# Altium schematic sheet 02 POWER,BEEP,IrDA.SchDoc
size 513 x 386 mm
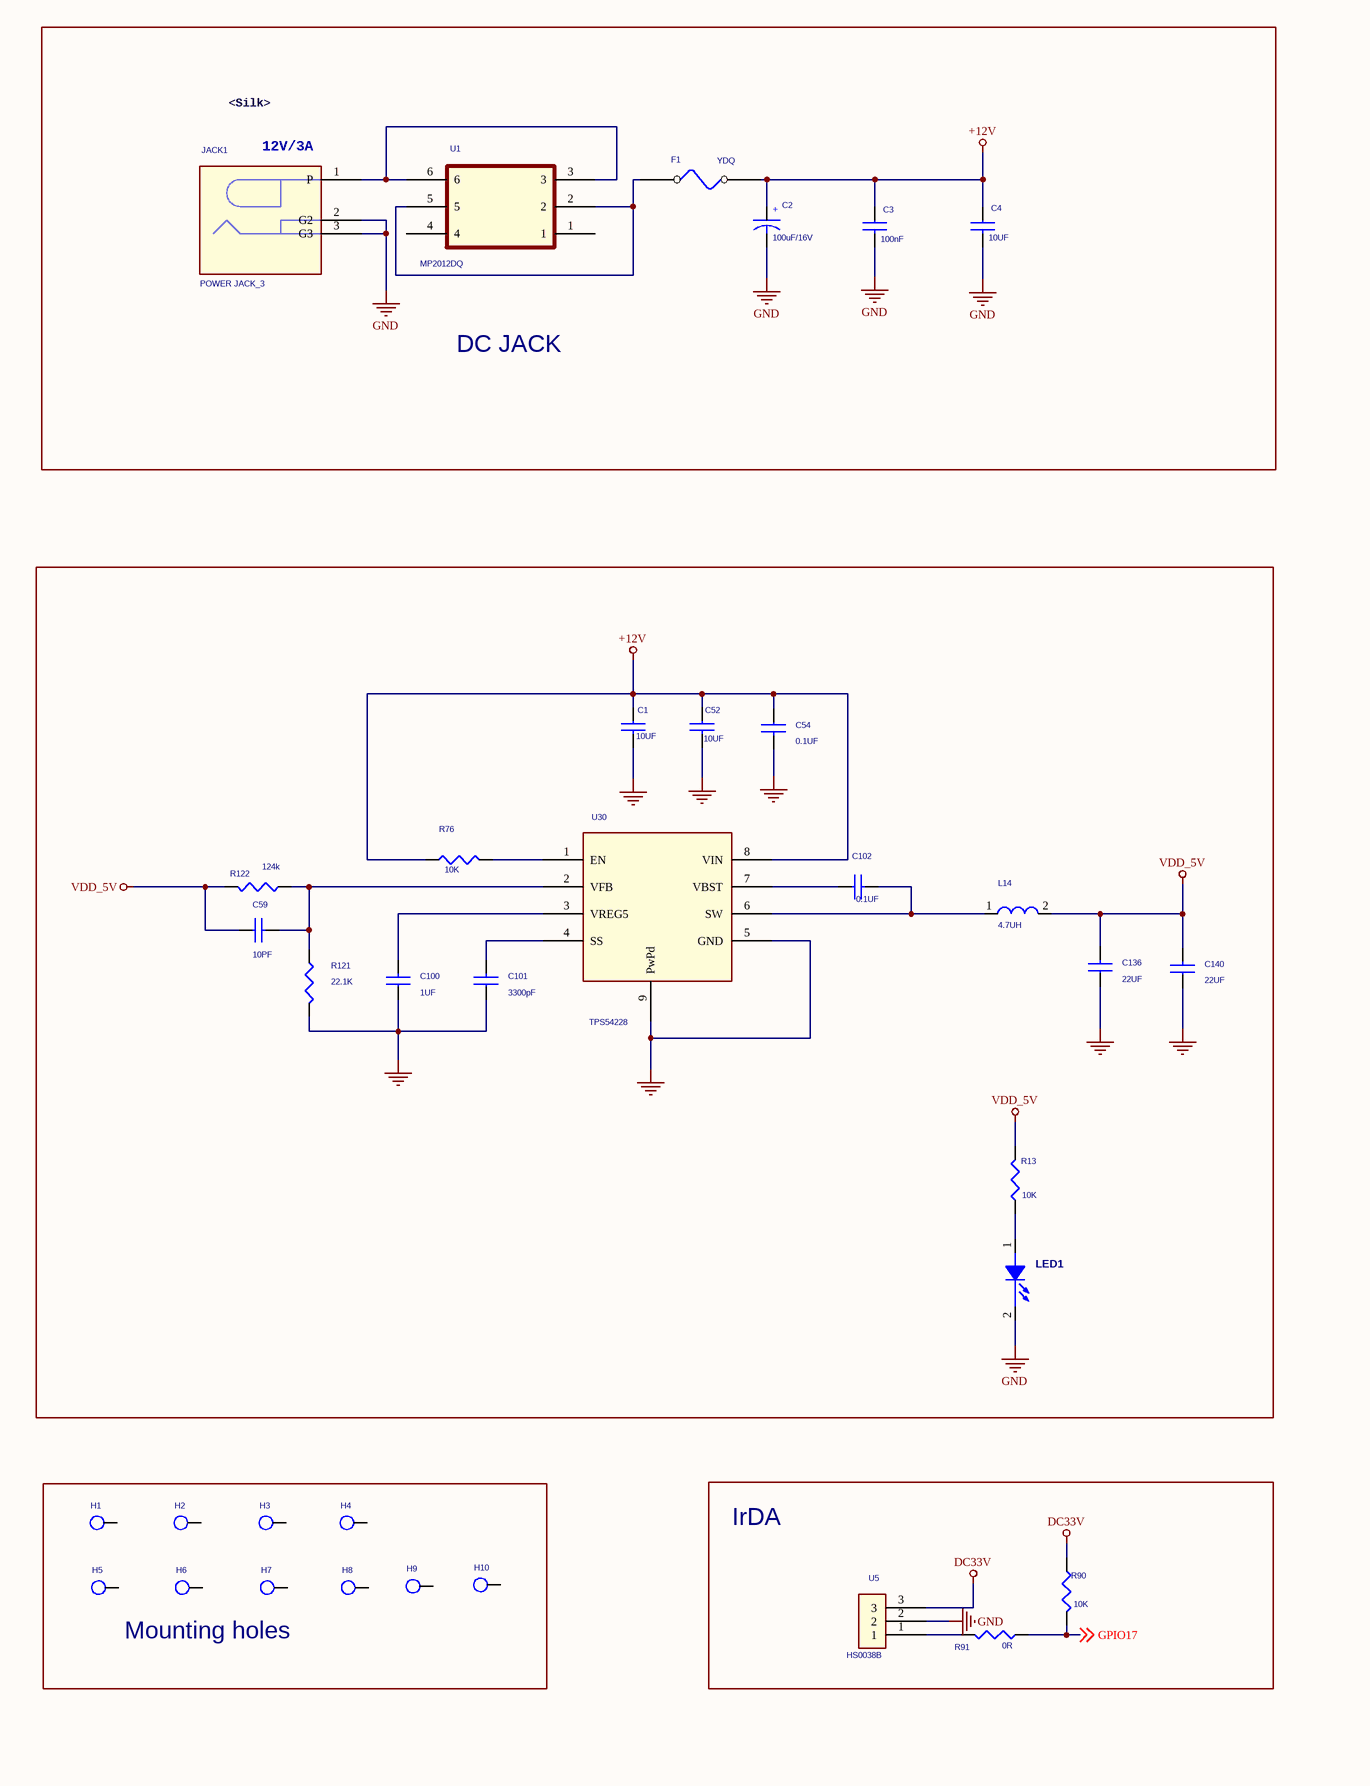
[diagram p0: 02 POWER,BEEP,IrDA.SchDoc, left]
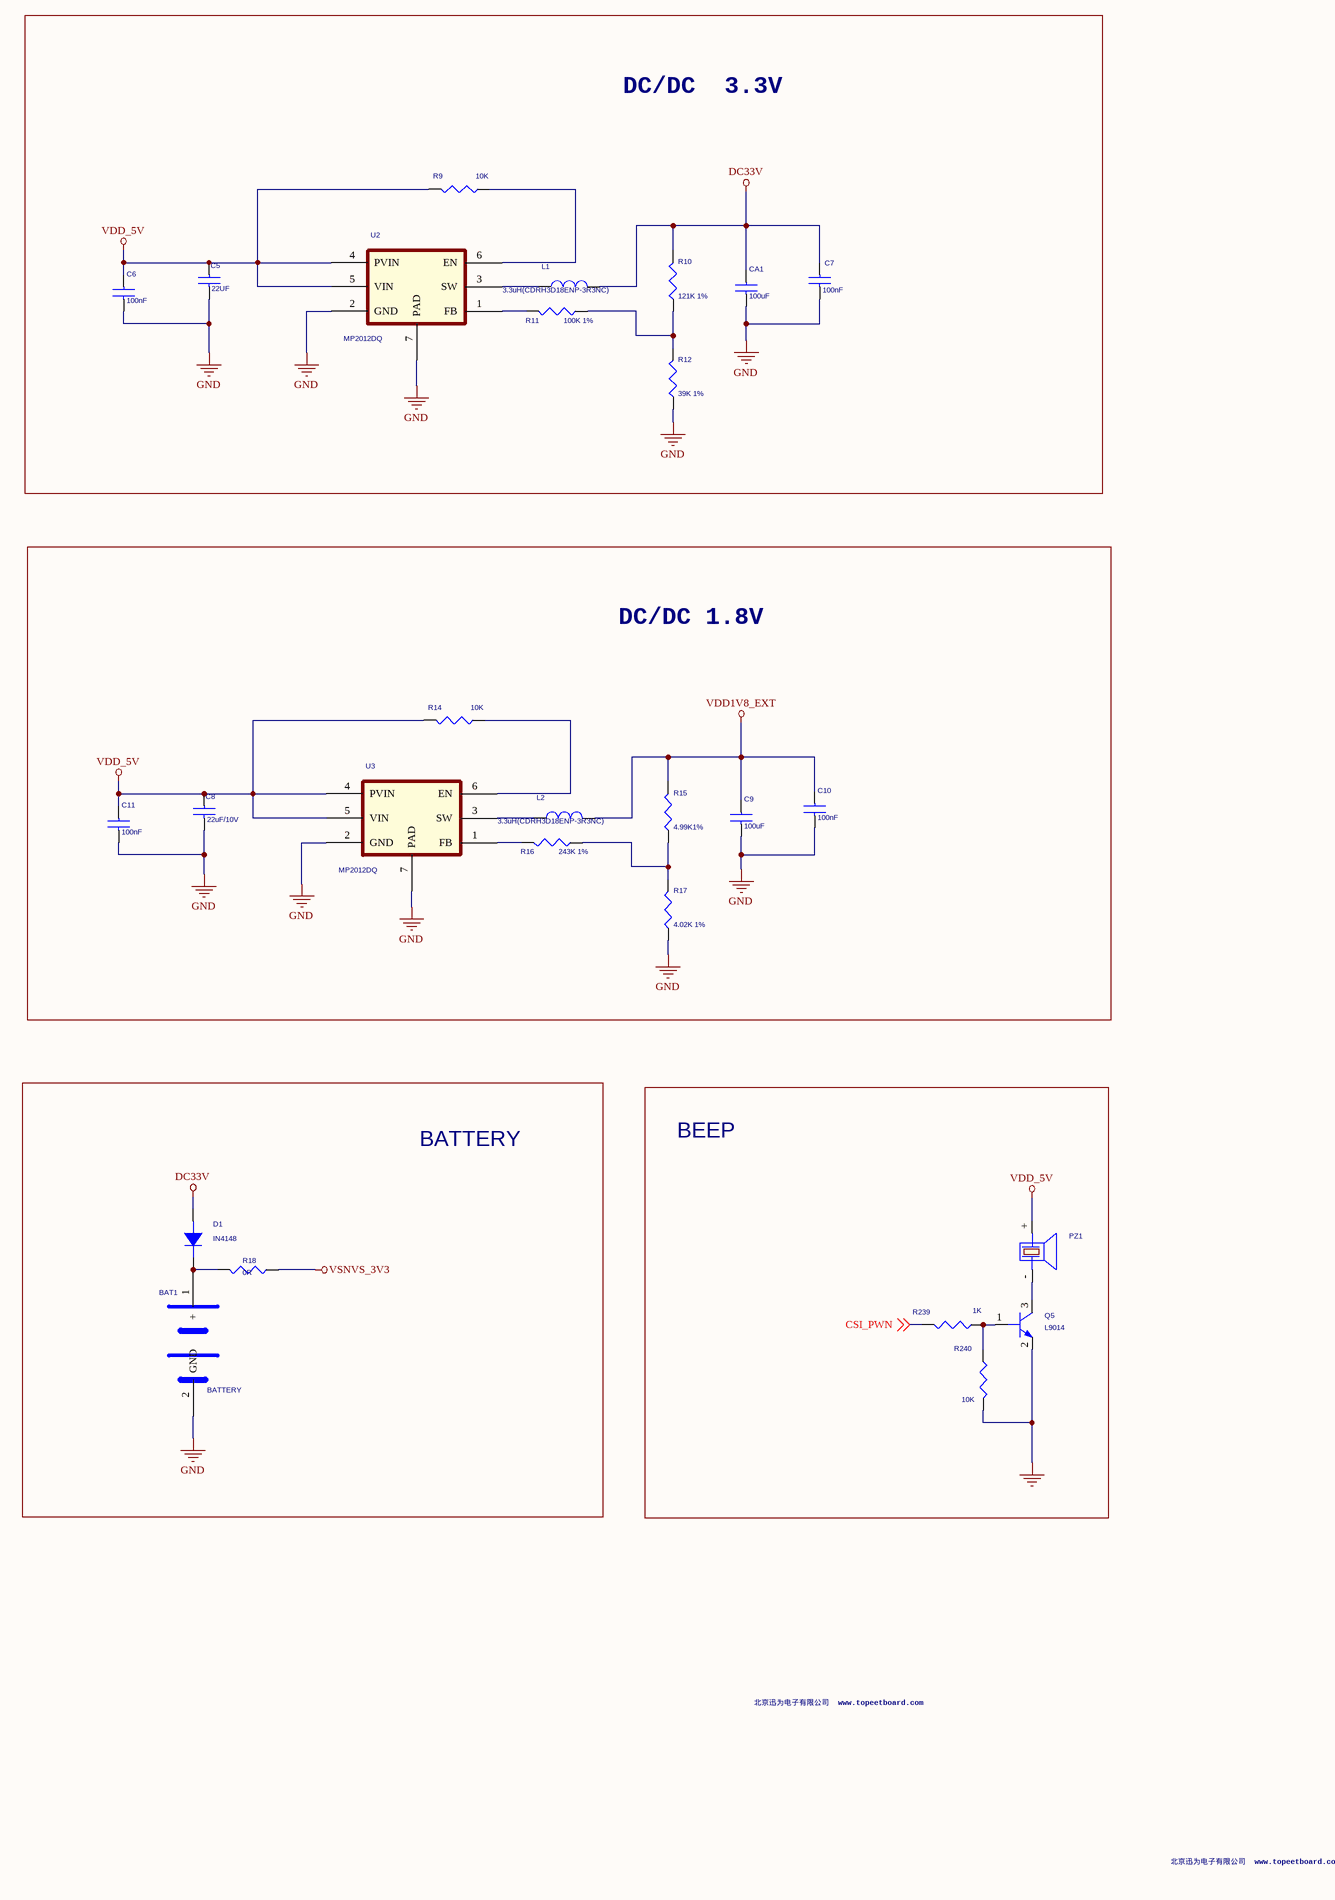
[diagram p1: 02 POWER,BEEP,IrDA.SchDoc, right]

## Parts
BAT1  BATTERY  [BATTERY]
C1  10UF  [C0603]
C2  100uF/16V  [T2012]
C3  100nF  [C1608]
C4  10UF  [C1608]
C5  22UF  [1206-A]
C6  100nF  [C1608]
C7  100nF  [C1608]
C8  22uF/10V  [1206-A]
C9  100uF  [C1608]
C10  100nF  [C1608]
C11  100nF  [C1608]
C52  10UF  [C0603]
C54  0.1UF  [C0402]
C59  10PF  [C0402]
C100  1UF  [C0402]
C101  3300pF  [C0402]
C102  0.1UF  [C0402]
C136  22UF  [C0805]
C140  22UF  [C0805]
CA1  100uF  [C1608]
D1  IN4148  [D1206]
F1  YDQ  [0805]
H1  TP_P0_0.8_D0  [TP_08]  (value not drawn)
H2  TP_P0_0.8_D0  [TP_08]  (value not drawn)
H3  TP_P0_0.8_D0  [TP_08]  (value not drawn)
H4  TP_P0_0.8_D0  [TP_08]  (value not drawn)
H5  TP_P0_0.8_D0  [TP_08]  (value not drawn)
H6  TP_P0_0.8_D0  [TP_08]  (value not drawn)
H7  TP_P0_0.8_D0  [TP_08]  (value not drawn)
H8  TP_P0_0.8_D0  [TP_08]  (value not drawn)
H9  TP_P0_0.8_D0  [TP_08]  (value not drawn)
H10  TP_P0_0.8_D0  [TP_08]  (value not drawn)
JACK1  POWER JACK_3  [jack-2_5mm_b]
L1  3.3uH(CDRH3D18ENP-3R3NC)  [LQH32C]
L2  3.3uH(CDRH3D18ENP-3R3NC)  [LQH32C]
L14  4.7UH  [LQH32C]
LED1  LED-Red (SMD 2012)  [LED-3216]  (value not drawn)
PZ1  PIEZO BUZZER_2  [SPEAKER]  (value not drawn)
Q5  L9014  [SOT-23]
R9  10K  [R1005]
R10  121K 1%  [R1005]
R11  100K 1%  [R1005]
R12  39K 1%  [R1005]
R13  10K  [R1005]
R14  10K  [R1005]
R15  4.99K1%  [R1005]
R16  243K 1%  [R1005]
R17  4.02K 1%  [R1005]
R18  0R  [R0603]
R76  10K  [R0402]
R90  10K  [R0402]
R91  0R  [R0402]
R121  22.1K  [R0402]
R122  124k  [R0402]
R239  1K  [R0402]
R240  10K  [R0402]
U1  MP2012DQ  [QFN6]
U2  MP2012DQ  [QFN6]
U3  MP2012DQ  [QFN6]
U5  HS0038B  [DIP3-HS0038B]
U30  TPS54228  [soic8-lh]

## Blocks framed on the sheet
DC JACK: C2-C4 F1 JACK1 U1
DC/DC  3.3V: C5-C7 CA1 L1 R9-R12 U2
DC/DC 1.8V: C8-C11 L2 R14-R17 U3
BATTERY: BAT1 D1 R18
BEEP: PZ1 Q5 R239 R240
Mounting holes: H1-H10
IrDA: R90 R91 U5

## Nets
+12V: C1.1 C2.1 C3.1 C4.1 C52.1 C54.1 F1.2 R76.1 U30.8(VIN)
DC33V: C7.1 CA1.1 D1.1(A) L1.2 R10.2 R90.1 U5.3
GND: BAT1.2(GND) C1.2 C2.2 C3.2 C4.2 C5.2 C6.2 C7.2 C8.2 C9.2 C10.2 C11.2 C52.2 C54.2 C100.1 C101.1 C136.1 C140.1 CA1.2 JACK1.2(G2) JACK1.3(G3) LED1.2(CATHODE) Q5.2(EMITTER) R12.1 R17.1 R121.2 R240.2 U2.2(GND) U2.7(PAD) U3.2(GND) U3.7(PAD) U5.2 U30.5(GND) U30.9(PwPd)
VDD1V8_EXT: C9.1 C10.1 L2.2 R15.2
VDD_5V: C5.1 C6.1 C8.1 C11.1 C59.1 C136.2 C140.2 L14.2 PZ1.+ R9.2 R13.2 R14.2 R122.2 U2.4(PVIN) U2.5(VIN) U3.4(PVIN) U3.5(VIN)
VSNVS_3V3: R18.1
CSI_PWN: R239.2 ; off-sheet CSI_PWN
GPIO17: R90.2 R91.1 ; off-sheet GPIO17
NetBAT1_1: BAT1.1(+) D1.2(K) R18.2
NetC59_2: C59.2 R121.1 R122.1 U30.2(VFB)
NetC100_2: C100.2 U30.3(VREG5)
NetC101_2: C101.2 U30.4(SS)
NetC102_1: C102.1 U30.7(VBST)
NetC102_2: C102.2 L14.1 U30.6(SW)
NetF1_1: F1.1 U1.2 U1.5
NetJACK1_1: JACK1.1(P) U1.3 U1.6
NetL1_1: L1.1 U2.3(SW)
NetL2_1: L2.1 U3.3(SW)
NetLED1_1: LED1.1(ANODE) R13.1
NetPZ1_-: PZ1.- Q5.3(COLLECTOR)
NetQ5_1: Q5.1(BASE) R239.1 R240.1
NetR9_1: R9.1 U2.6(EN)
NetR10_1: R10.1 R11.1 R12.2
NetR11_2: R11.2 U2.1(FB)
NetR14_1: R14.1 U3.6(EN)
NetR15_1: R15.1 R16.1 R17.2
NetR16_2: R16.2 U3.1(FB)
NetR76_2: R76.2 U30.1(EN)
NetR91_2: R91.2 U5.1

Not connected (* = marked no-connect by the designer): H1 1; H2 1; H3 1; H4 1; H5 1; H6 1; H7 1; H8 1; H9 1; H10 1; U1 1 4

## Notes on the sheet
- <Silk>
- (near JACK1) 12V/3A
- 北京迅为电子有限公司  www.topeetboard.com
- (in symbol CT2012_0) +

## Library data of the parts
BAT1 = BATTERY_0
C1 C52 C54 C59 C100-C102 C136 C140 = CAP NP
C2 = CT2012_0
C3 C4 C6 C7 C9-C11 CA1 = C1608_Dup2
C5 C8 = C1206_0
D1 = DIODE
F1 = FUSE
L1 L2 = LQH32C_0_Dup2
L14 = LQH32C_0_Dup1
LED1 = LED-RED_SMD_1
Q5 = L14P2/TO_1
R9-R17 = R1005_0_Dup2
R18 R76 R90 R91 R121 R122 R239 R240 = R_Dup1
U1 = U-MP2012DQ_0
U2 U3 = U-MP2012DQ
U5 = HS0038
U30 = RT8065_5